# EAGLE schematic LIS344ALH (EAGLE 9.6.2)
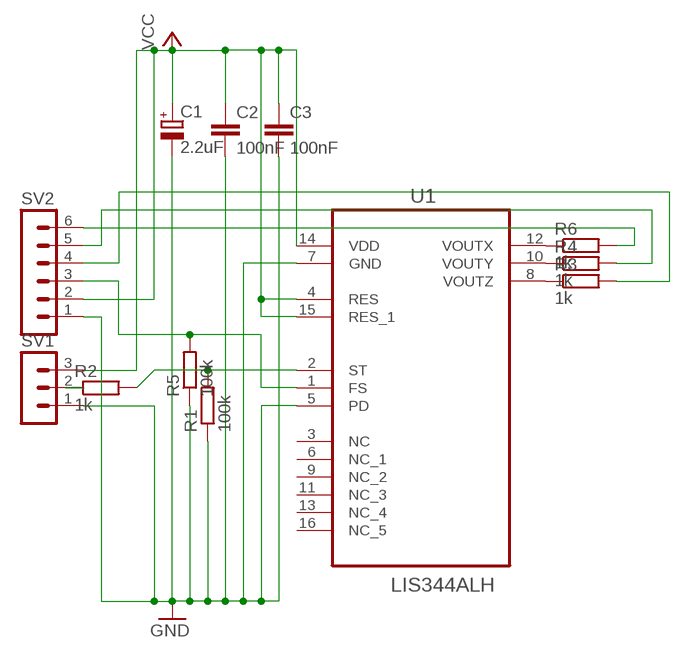
[diagram p0: schematic, sheet 1]

## Parts
C1  2.2uF  CPOL-EUE2,5-6E  [E2,5-6E]
C2  100nF  C2.5/2  [C2.5-2]
C3  100nF  C2.5/2  [C2.5-2]
R1  100k  R-EU_0204/7  [0204/7]
R2  1k  R-EU_0204/7  [0204/7]
R3  1k  R-EU_0204/7  [0204/7]
R4  1k  R-EU_0204/7  [0204/7]
R5  100k  R-EU_0204/7  [0204/7]
R6  1k  R-EU_0204/7  [0204/7]
SV1  MA03-1  [MA03-1]
SV2  MA06-1  [MA06-1]
U1  LIS344ALH  [LGA16R65P4X4_400X400X160]

## Nets
GND: C1.- C2.2 C3.2 R1.1 R5.1 SV1.1 SV2.1 U1.5(PD) U1.7(GND)
N$1: R6.1 U1.12(VOUTX)
N$2: R4.1 U1.10(VOUTY)
N$3: R3.1 U1.8(VOUTZ)
N$4: R6.2 SV2.6
N$5: R4.2 SV2.5
N$6: R3.2 SV2.4
N$7: R2.1 SV1.2
N$8: R1.2 R2.2 U1.2(ST)
N$11: R5.2 SV2.3 U1.1(FS)
VCC: C1.+ C2.1 C3.1 SV1.3 SV2.2 U1.4(RES) U1.14(VDD) U1.15(RES_1)
Unconnected: U1.3(NC) U1.6(NC_1) U1.9(NC_2) U1.11(NC_3) U1.13(NC_4) U1.16(NC_5)

## Library data of the parts
C1 = rcl:CPOL-EU: POLARIZED CAPACITOR, European symbol; SPICEPREFIX: C
C2 C3 = capacitor-wima:C: CAPACITOR naming: grid - package width
R1-R6 = rcl:R-EU_: RESISTOR, European symbol; SPICEPREFIX: R
SV1 = con-lstb:MA03-1: PIN HEADER; OC_FARNELL: unknown; OC_NEWARK: unknown
SV2 = con-lstb:MA06-1: PIN HEADER; OC_FARNELL: unknown; OC_NEWARK: unknown
U1 = LIS344ALH:LIS344ALH: Check availability <https://pricing.snapeda.com/parts/LIS344ALH/STMicroelectronics/view-part?ref=eda>; AVAILABILITY: In Stock; CHECK_PRICES: https://www.snapeda.com/parts/LIS344ALH/STMicroelectronics/view-part/?ref=eda; DESCRIPTION: Accelerometer X, Y, Z Axis ±2g, 6g 1.8kHz 16-LGA (4x4); MF: STMicroelectronics; MP: LIS344ALH; PACKAGE: LGA-16 STMicroelectronics; PRICE: None; SNAPEDA_LINK: https://www.snapeda.com/parts/LIS344ALH/STMicroelectronics/view-part/?ref=snap